# EAGLE design amp-LNA-L-band-TQP3M9037 (EAGLE 9.2.2)
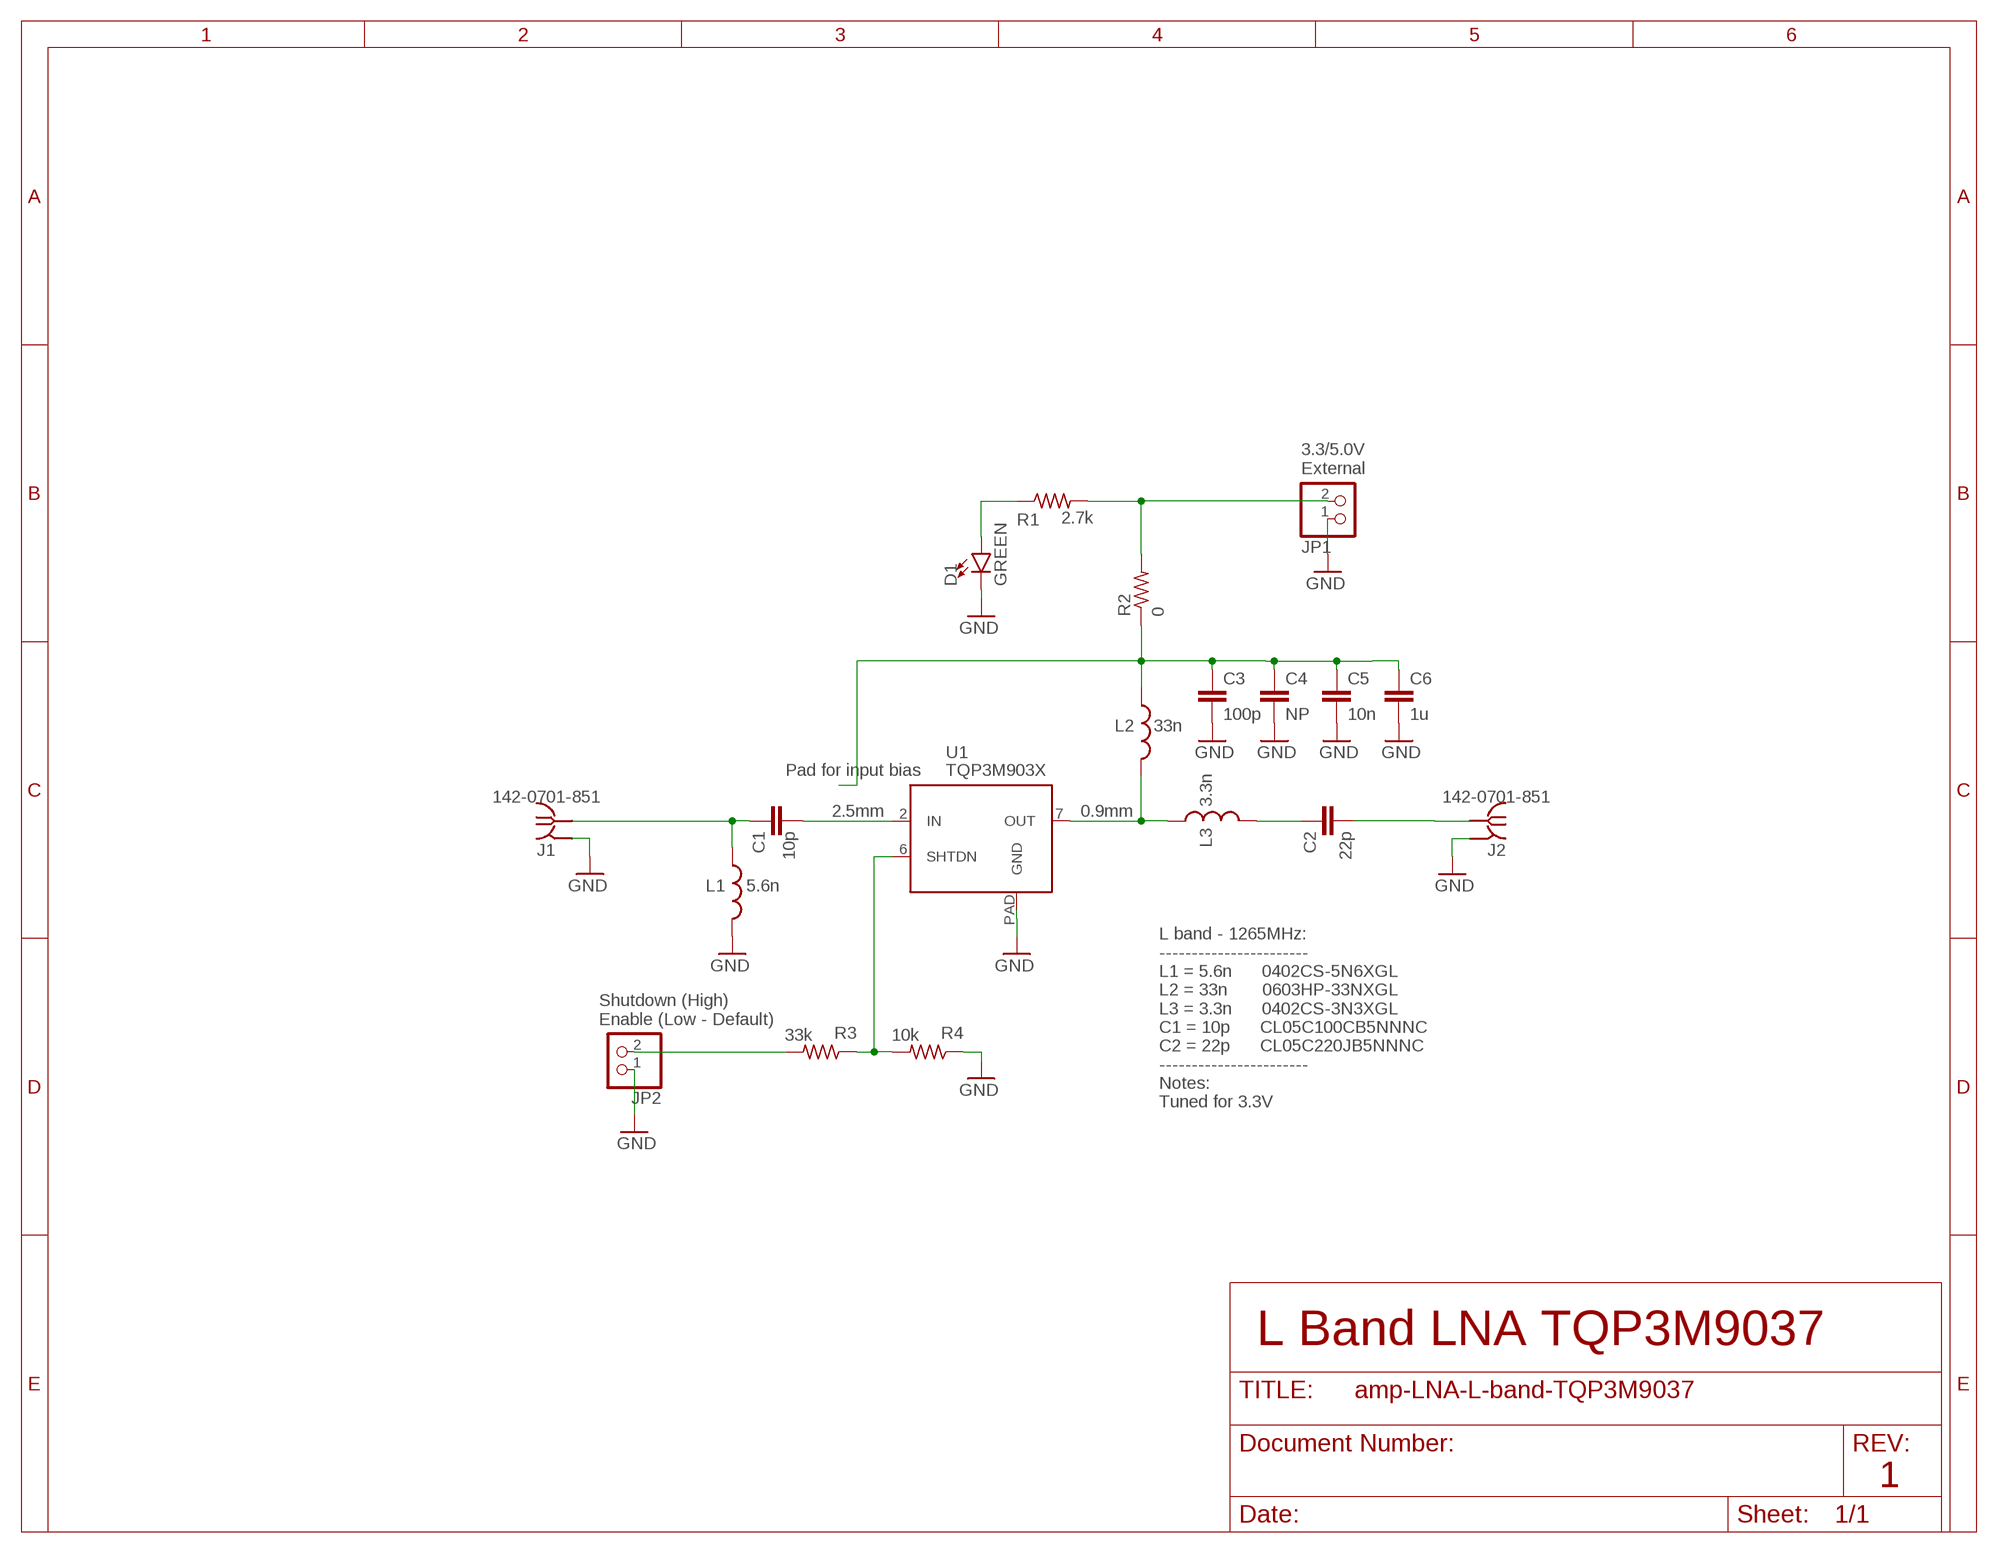
[diagram p0: schematic, sheet 1]

## Parts
C1  10p  C-EU0402-C-NOSILK  [.0402-C-NOSILK]
C2  22p  C-EU0402-C-NOSILK  [.0402-C-NOSILK]
C3  100p  C-EU0603-B-NOSILK  [.0603-B-NOSILK]
C4  NP  C-EU0603-B-NOSILK  [.0603-B-NOSILK]
C5  10n  C-EU0603-B-NOSILK  [.0603-B-NOSILK]
C6  1u  C-EU0603-B-NOSILK  [.0603-B-NOSILK]
D1  GREEN  LED-GREEN0603  [LED-0603]
J1  142-0701-851  [142-0701-851]
J2  142-0701-851  [142-0701-851]
JP1  PINHD-1X2  [1X02]
JP2  PINHD-1X2  [1X02]
L1  5.6n  L-US0402-C-NOSILK  [.0402-C-NOSILK]
L2  33n  L-US0603-C-NOSILK  [.0603-C-NOSILK]
L3  3.3n  L-US0402-C-NOSILK  [.0402-C-NOSILK]
R1  2.7k  R-US_0603-B-NOSILK  [.0603-B-NOSILK]
R2  0  R-US_0603-B-NOSILK  [.0603-B-NOSILK]
R3  33k  R-US_0603-B-NOSILK  [.0603-B-NOSILK]
R4  10k  R-US_0603-B-NOSILK  [.0603-B-NOSILK]
U1  TQP3M903X  [DFN8-2X2-WITH-PAD]

## Nets
GND: C3.2 C4.2 C5.2 C6.2 D1.C J1.GND1(GND) J1.GND2(GND) J1.GND3(GND) J1.GND4(GND) J2.GND1(GND) J2.GND2(GND) J2.GND3(GND) J2.GND4(GND) JP1.1 JP2.1 L1.2 R4.1 U1.PAD(GND)
N$1: JP1.2 R1.2 R2.2
N$2: R3.1 R4.2 U1.6(SHTDN)
N$3: JP2.2 R3.2
N$4 [RF1]: C1.2 U1.2(IN)
N$5 [RF2]: C2.1 L3.2
N$21: D1.A R1.1
N$28 [RF1]: L2.2 L3.1 U1.7(OUT)
N$47: C3.1 C4.1 C5.1 C6.1 L2.1 R2.1
RF_IN [RF2]: C1.1 J1.RF1(RF) L1.1
RF_OUT [RF2]: C2.2 J2.RF1(RF)

## Notes on the sheet
- 3.3/5.0V
  External
- Pad for input bias
- 2.5mm | 0.9mm
- L band - 1265MHz:
  -----------------------
  L1 = 5.6n      0402CS-5N6XGL
  L2 = 33n       0603HP-33NXGL
  L3 = 3.3n      0402CS-3N3XGL
  C1 = 10p      CL05C100CB5NNNC
  C2 = 22p      CL05C220JB5NNNC
  -----------------------
  Notes:
  Tuned for 3.3V
- Shutdown (High)
  Enable (Low - Default)
- L Band LNA TQP3M9037
- 1

## Library data of the parts
C1-C6 = oresat-rcl:C-EU: CAPACITOR, European symbol
D1 = SparkFun-LED:LED-GREEN: Green SMD LED Used in manufacturing of various products at SparkFun Packages: 0603 - SMD 0603 package [Product Link] <http://www.futureelectronics.com/en/technologies/semiconductors/optoelectronics/leds/Pages/9894312-LTST-C190GKT.aspx?CrossPart=HSMG-C190&IM=0> LilyPad 1206 - SMD1206 LilyPad package [Product Link] <http://www.futureelectronics.com/en/Technologies/Product.aspx?ProductID=IN150NGHARVATEKCORPORATION2049943&IM=0> 1206 - SMD1206 package [Product Link] <http://www.futureelectronics.com/en/technologies/semiconductors/optoelectronics/leds/Pages/8315665-LTST-C150KGKT.aspx?IM=0> 1206 Bottom Mount -SMD 1206 Bottom Mount [Product Link] <http://www.digikey.com/product-detail/en/lite-on-inc/LTST-C230KGKT/160-1456-1-ND/386854> SparkFun Products: Pro Mini 328 -5V <https://www.sparkfun.com/products/821> RedBoard <https://www.sparkfun.com/products/12757> MP3 Trigger <https://www.sparkfun.com/products/13720> Makey Makey <https://www.sparkfun.com/products/11076>
J1 J2 = J-Cinch-142-0701-851-SMA-end-launch:142-0701-851: SMA Jack 50Ω - End Launch Source: Datasheet <https://belfuse.com/resources/productinformations/cinchconnectivitysolutions/johnson/pi-ccs-john-142-0701-851.pdf>
JP1 JP2 = pinhead:PINHD-1X2: PIN HEADER
L1-L3 = oresat-rcl:L-US: INDUCTOR, American symbol
R1-R4 = oresat-rcl:R-US_: RESISTOR, American symbol
U1 = U-Qorvo-TQP3M903x-LNA:TQP3M903X: Ultra Low Noise, High Linearity LNAs TQP3M9035: 0.05 - 6.0 GHz Operational Bandwidth Source: Datasheet <https://www.qorvo.com/products/p/TQP3M9035> TQP3M9036: 0.1 - 2.0 GHz Operational Bandwidth Source: Datasheet <https://www.qorvo.com/products/p/TQP3M9036> TQP3M9037: 0.7 - 6.0 GHz Operational Bandwidth Source: Datasheet <https://www.qorvo.com/products/p/TQP3M9037>

## Net classes
1 RF1: clearance 0.5 mm
2 RF2: clearance 0.8 mm

## Board
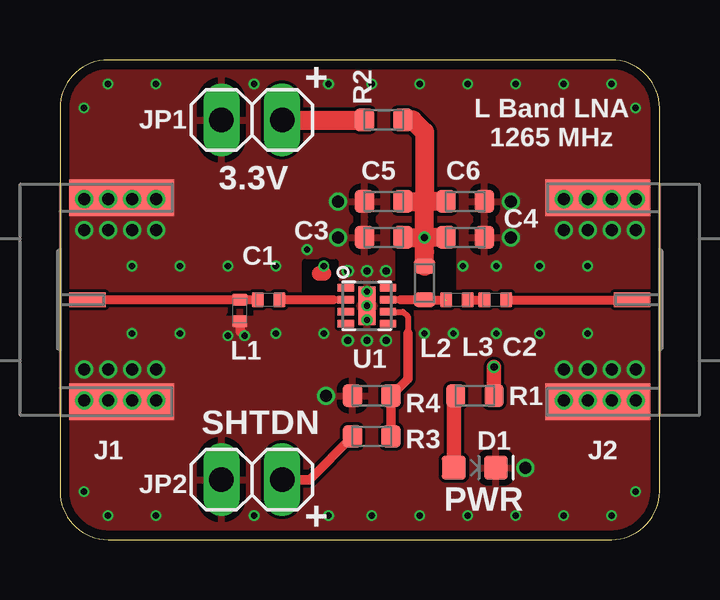
[diagram p1: board, top side]
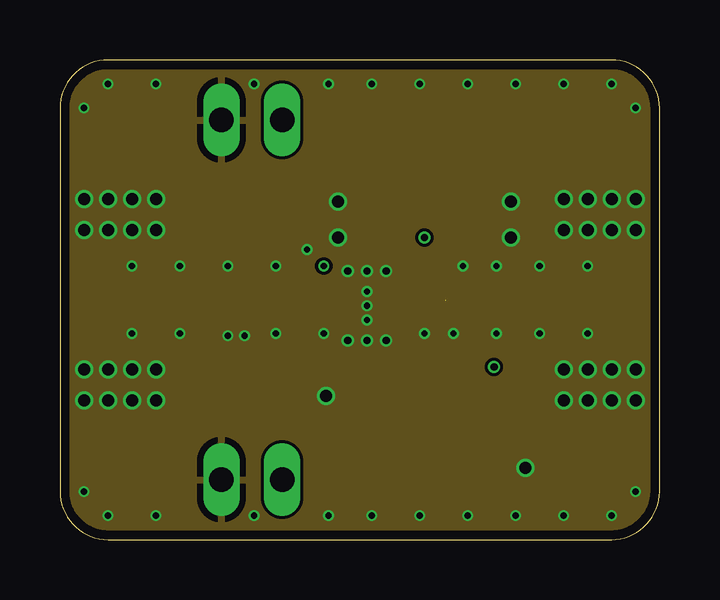
[diagram p2: board, inner layer Route2]
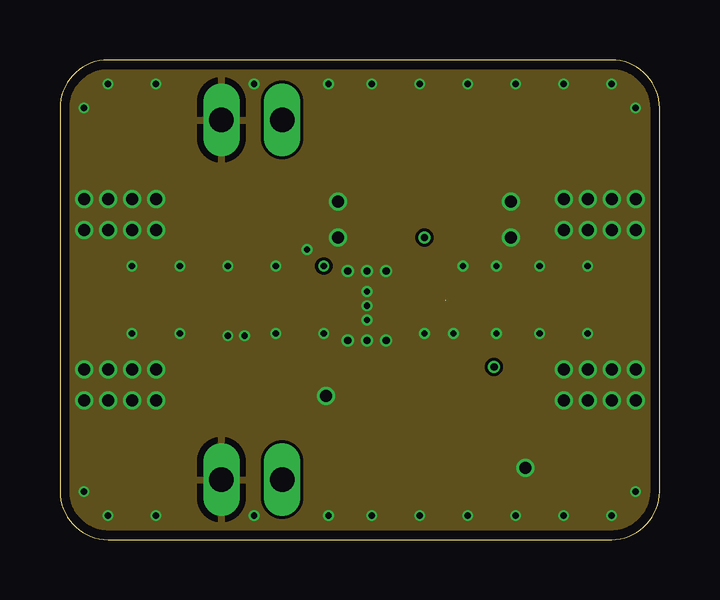
[diagram p3: board, inner layer Route15]
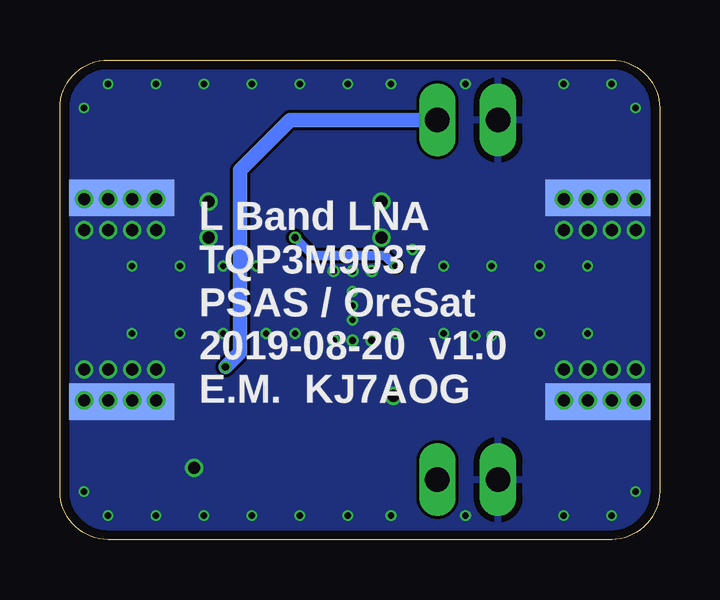
[diagram p4: board, bottom side, seen from below]

Size 25 x 20 mm. Coordinates in mm from the lower left corner, seen from the top.
Outline: 0,18 0,2 arc90 2,0 23,0 arc90 25,2 25,18 arc90 23,20 2,20 arc90 0,18
Copper layers (1*2*15*16): Top 0.035559375mm / dielectric 0.17018125mm / Route2 0.01778125mm / dielectric 47mil / Route15 0.01778125mm / dielectric 0.17018125mm / Bottom 0.035559375mm
Design rules "oshpark-4layer-tented": minimum track width 5mil, minimum drill 10mil, track to track 5mil, track to pad 5mil, pad to pad 5mil, via to via 5mil, smd to smd 5mil, copper to edge 15mil, drill to drill 6mil, minimum pad ring 4mil, minimum via ring 4mil, stop-mask expansion 2.5mil, vias tented up to drill 20mil, thermal gap 10mil

### Footprints (pad centres in the part's own frame; a part is rotated, then mirrored left to right if it is on the bottom)
.0402-C-NOSILK = smd 0.5 x 0.6: 1 -0.45,0; 2 0.45,0
.0603-B-NOSILK = smd 0.8 x 0.95: 1 -0.8,0; 2 0.8,0
LED-0603 = smd 1 x 1: A -0.877,0; C 0.877,0
142-0701-851 = smd 1.524 x 4.37: GND1 -4.255,-2.566; GND2 4.255,-2.566 | smd 1.524 x 4.37 bottom: GND3 -4.255,-2.566; GND4 4.255,-2.566 | smd 0.6 x 1.53: RF1 0,-1.146
1X02 = drill 1.016 long: 1 -1.27,0; 2 1.27,0
.0603-C-NOSILK = smd 0.6 x 0.9: 1 -0.7,0; 2 0.7,0
DFN8-2X2-WITH-PAD = smd 0.3 x 0.67: 1 -0.75,-0.885; 2 -0.25,-0.885; 3 0.25,-0.885; 4 0.75,-0.885; 5 0.75,0.885; 6 0.25,0.885; 7 -0.25,0.885; 8 -0.75,0.885 | smd 1.6 x 0.7: PAD 0,0

### Placement (x,y rotation side)
C1  8.7,10 0 top
C2  18.15,10 0 top
C3  13.5,12.6 180 top
C4  16.9,12.6 0 top
C5  13.5,14.1 180 top
C6  16.9,14.1 0 top
D1  17.3,3 0 top
J1  0,10 90 top
J2  25,10 270 top
JP1  8,17.5 0 top
JP2  8,2.5 0 top
L1  7.5,9.55 270 top
L2  15.2,10.7 270 top
L3  16.55,10 0 top
R1  17.3,6 0 top
R2  13.5,17.5 180 top
R3  13,4.3 180 top
R4  13,6 0 top
U1  12.8,9.75 270 top

### Tracks (layer width: path | path; a pad name or v marks a point on that pad's centre or on a via)
GND  (via drill 0.25, 0.3, 0.5)
  Top 0.4: L1.2 7.5,8.7 v7.7,8.5
  other vias: 12.8,9.15 12.8,10.35 12.8,9.75 18.8,12.6 18.8,14.1 11.6,14.1 11.6,12.6 12.8,11.2 12,11.2 13.6,11.2 12.8,8.3 12,8.3 13.6,8.3 1,7.1 2,7.1 4,7.1 1,5.8 2,5.8 4,5.8 1,12.9 2,12.9 4,12.9 1,14.2 2,14.2 4,14.2 24,14.2 23,14.2 21,14.2 21,12.9 23,12.9 24,12.9 24,5.8 23,5.8 21,5.8 21,7.1 23,7.1 24,7.1 3,8.6 5,8.6 7,8.5 9,8.6 11,8.6 3,11.4 5,11.4 7,11.4 9,11.4 10.3,12.1 22,8.6 20,8.6 18.2,8.6 16.4,8.6 15.2,8.6 22,11.4 20,11.4 18.2,11.4 16.8,11.4 1,2 2,1 4,1 8.1,1 23,1 24,2 21,1 19,1 17,1 15,1 13,1 11.2,1 1,18 2,19 4,19 8.1,19 24,18 23,19 21,19 19,19 17,19 15,19 13,19 11.2,19 11.1,6 19.4,3 3,12.9 3,14.2 3,7.1 3,5.8 22,7.1 22,5.8 22,12.9 22,14.2
  pour Top: 0,0 25,0 25,20 0,20
  pour Bottom: 0,0 25,0 25,20 0,20
  cutout Top: 14.1,12 16.4,12 16.4,10.4 14.1,10.4
  cutout Top: 10.2,11.6 11.5,11.6 11.5,10.4 10.2,10.4
  pour Top (no thermals): 0,15.5 5.3,15.5 5.3,4.5 0,4.5
  pour Top (no thermals): 19.7,15.5 25,15.5 25,4.5 19.7,4.5
  pour Bottom (no thermals): 19.7,15.5 25,15.5 25,4.5 19.7,4.5
  pour Bottom (no thermals): 0,15.5 5.3,15.5 5.3,4.5 0,4.5
  pour Route2: 0,0 25,0 25,20 0,20
  pour Route15: 0,0 25,0 25,20 0,20
  pour Top (no thermals): 6.9,9.2 8.1,9.2 8.1,8.2 6.9,8.2
N$1  (via drill 0.3)
  Top 0.6: v18.1,7.2 R1.2
  Top 0.8: JP1.2 R2.2
  Bottom 0.6: JP1.2 15.4,17.5 17.5,15.4 17.5,7.8 v18.1,7.2
N$2
  Top 0.25: U1.6 14.3,9.5 14.5,9.3 14.5,8.6
  Top 0.4: R3.1 R4.2 14.5,6.7 14.5,8.6
N$3
  Top 0.4: JP2.2 10.4,2.5 R3.2
N$4
  Top 0.3: U1.2 11.4,10
  Top 0.37: 11.4,10 C1.2
N$5
  Top 0.37: L3.2 C2.1
N$21
  Top 0.6: R1.1 16.42,5.92 D1.A
N$28  (1 unrouted)
  Top 0.3: 14.2,10 U1.7
  Top 0.37: 14.2,10 L2.2 16.07,10
N$47  (via drill 0.25, 0.3)
  Top 0.4: v11,11.4 11,11.1
  Top 0.6: 11,11.1 10.8,11.1
  Top 0.8: L2.1 15.2,12 v15.2,12.6 | v15.2,12.6 15.2,14.1 | C5.1 15.2,14.1 | C6.1 15.2,14.1 | C3.1 v15.2,12.6 | C4.1 v15.2,12.6 | R2.1 14.7,17.5 15.2,17 15.2,14.1
  Bottom 0.4: v11,11.4 11.45,11.85 14.45,11.85 v15.2,12.6
RF_IN
  Top 0.37: C1.1 L1.1 J1.RF1
  pour Top: 1.7,10.2 1.9,10.2 2.1,10 1.9,9.8 1.7,9.8
RF_OUT
  Top 0.37: C2.2 J2.RF1
  pour Top: 23.2,10.2 23.1,10.2 22.9,10 23.1,9.8 23.2,9.8

### Text on the board
tPlace: + | L Band LNA / 1265 MHz | 3.3V | SHTDN | PWR | +
bPlace: L Band LNA / TQP3M9037 / PSAS / OreSat / 2019-08-20 v1.0 / E.M. KJ7AOG